# Altium project Project_Controller_Motor_DC.PrjPcb
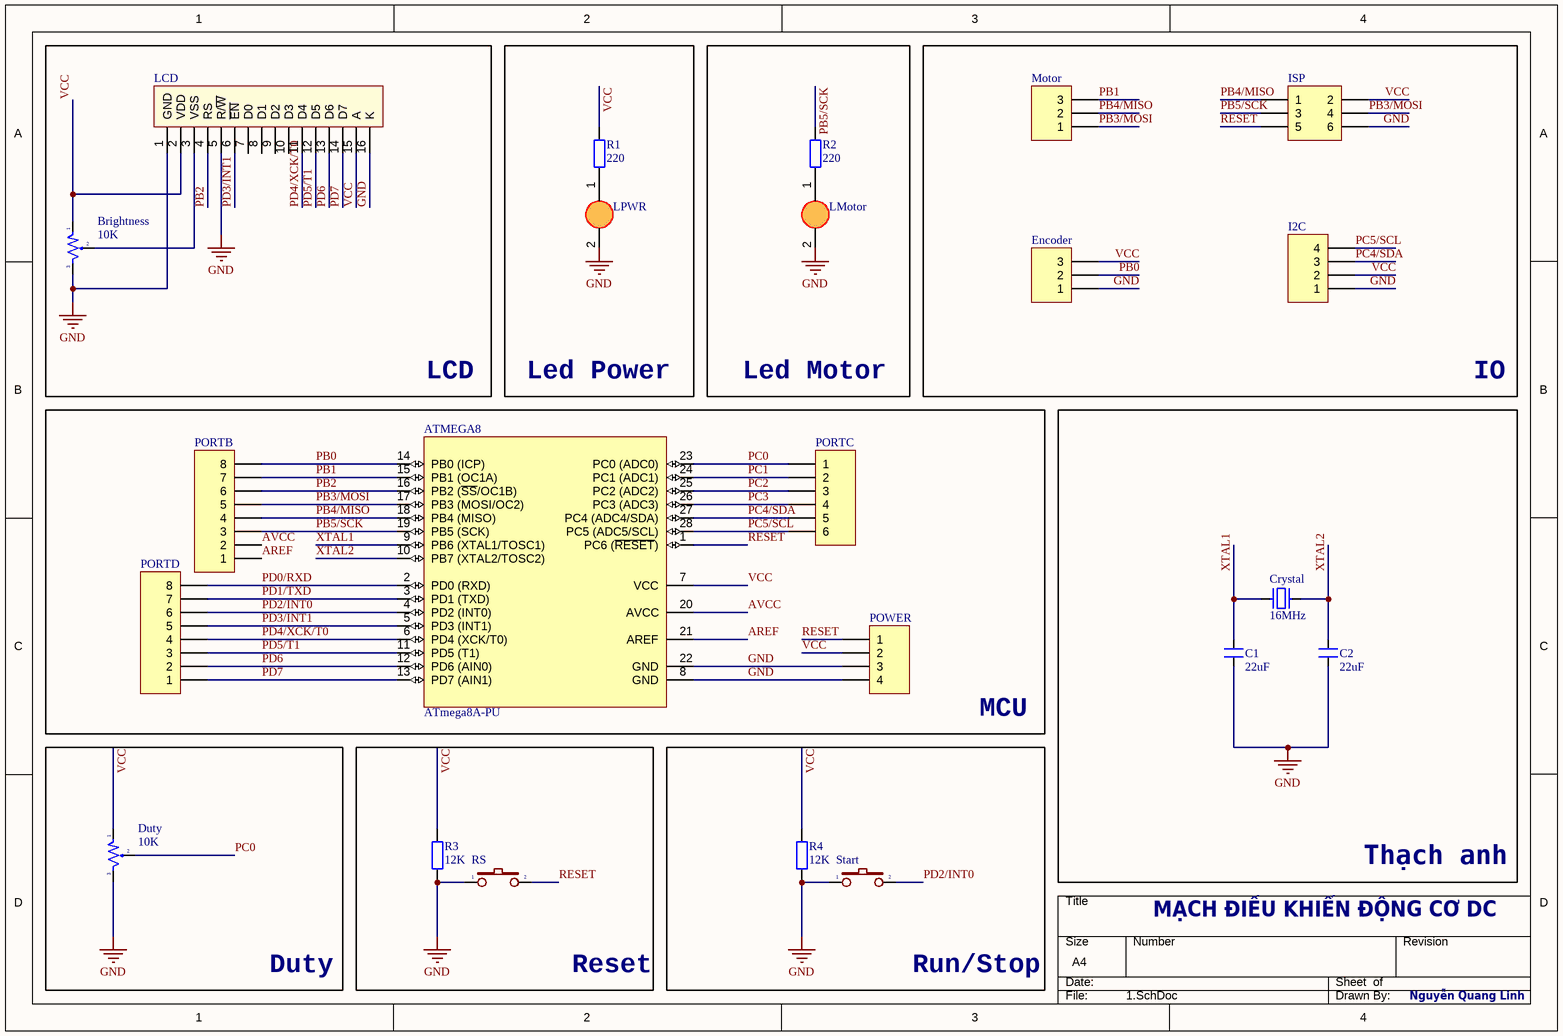
[diagram p0: 1.SchDoc]
1 sheet, 23 parts. Net scope: global (net labels, ports and power ports of the same name join across sheets).
Board file: PCB1.PcbDoc

## Sheet 1.SchDoc
size A4; SheetNumber: 1; SheetTotal: 1

### Parts
ATMEGA8  ATmega8A-PU  [28P3]
Brightness  10K  [VOL-S]
C1  22uF  [CN1.5]
C2  22uF  [CN1.5]
Crystal  16MHz  [XT2]
Duty  10K  [VOL-S]
Encoder  (no value)  [HDR1X3]
I2C  (no value)  [HDR1X4]
ISP  Header 3X2  [HDR2X3]  (value not drawn)
LCD  CD16x2A  [LCD16X2]  (value not drawn)
LMotor  LED5  [LED5MM]  (value not drawn)
LPWR  LED5  [LED5MM]  (value not drawn)
Motor  (no value)  [HDR1X3]
PORTB  Header 8  [HDR1X8]  (value not drawn)
PORTC  (no value)  [HDR1X6]
PORTD  (no value)  [HDR1X8]
POWER  Header 4  [HDR1X4]  (value not drawn)
R1  220  [RES-1/4W-SMALL]
R2  220  [RES-1/4W-SMALL]
R3  12K  [RES-1/4W-SMALL]
R4  12K  [RES-1/4W-SMALL]
RS  SW  [SW2]  (value not drawn)
Start  (no value)  [SW2]

### Blocks framed on the sheet
LCD: Brightness LCD
Led Power: LPWR R1
Led Motor: LMotor R2
IO: Encoder I2C ISP Motor
MCU: ATMEGA8 PORTB PORTC PORTD POWER
Thạch anh: C1 C2 Crystal
Duty: Duty
Reset: R3 RS
Run/Stop: R4 Start

### Nets
GND: ATMEGA8.8(GND) ATMEGA8.22(GND) Brightness.3 C1.1 C2.1 Duty.3 Encoder.1 I2C.1 ISP.6 LCD.1(GND) LCD.5(R/~{W}) LCD.16(K) LMotor.2(K) LPWR.2(K) POWER.3 POWER.4 R3.2 R4.2 RS.1 Start.1
AREF: ATMEGA8.21(AREF) PORTB.1
AVCC: ATMEGA8.20(AVCC) PORTB.2
PB0: ATMEGA8.14(PB0_(ICP)) Encoder.2 PORTB.8
PB1: ATMEGA8.15(PB1_(OC1A)) Motor.3 PORTB.7
PB2: ATMEGA8.16(PB2_(~{SS}/OC1B)) LCD.4(RS) PORTB.6
PB3/MOSI: ATMEGA8.17(PB3_(MOSI/OC2)) ISP.4 Motor.1 PORTB.5
PB4/MISO: ATMEGA8.18(PB4_(MISO)) ISP.1 Motor.2 PORTB.4
PB5/SCK: ATMEGA8.19(PB5_(SCK)) ISP.3 PORTB.3 R2.2
PC0: ATMEGA8.23(PC0_(ADC0)) Duty.2 PORTC.1
PC1: ATMEGA8.24(PC1_(ADC1)) PORTC.2
PC2: ATMEGA8.25(PC2_(ADC2)) PORTC.3
PC3: ATMEGA8.26(PC3_(ADC3)) PORTC.4
PC4/SDA: ATMEGA8.27(PC4_(ADC4/SDA)) I2C.3 PORTC.5
PC5/SCL: ATMEGA8.28(PC5_(ADC5/SCL)) I2C.4 PORTC.6
PD0/RXD: ATMEGA8.2(PD0_(RXD)) PORTD.8
PD1/TXD: ATMEGA8.3(PD1_(TXD)) PORTD.7
PD2/INT0: ATMEGA8.4(PD2_(INT0)) PORTD.6 Start.2
PD3/INT1: ATMEGA8.5(PD3_(INT1)) LCD.6(~{EN}) PORTD.5
PD4/XCK/T0: ATMEGA8.6(PD4_(XCK/T0)) LCD.11(D4) PORTD.4
PD5/T1: ATMEGA8.11(PD5_(T1)) LCD.12(D5) PORTD.3
PD6: ATMEGA8.12(PD6_(AIN0)) LCD.13(D6) PORTD.2
PD7: ATMEGA8.13(PD7_(AIN1)) LCD.14(D7) PORTD.1
RESET: ATMEGA8.1(PC6_(~{RESET})) ISP.5 POWER.1 RS.2
VCC: ATMEGA8.7(VCC) Brightness.1 Duty.1 Encoder.3 I2C.2 ISP.2 LCD.2(VDD) LCD.15(A) POWER.2 R1.2 R3.1 R4.1
XTAL1: ATMEGA8.9(PB6_(XTAL1/TOSC1)) C1.2 Crystal.2
XTAL2: ATMEGA8.10(PB7_(XTAL2/TOSC2)) C2.2 Crystal.1
NetBrightness_2: Brightness.2 LCD.3(VSS)
NetLMotor_1: LMotor.1(A) R2.1
NetLPWR_1: LPWR.1(A) R1.1

Not connected (* = marked no-connect by the designer): LCD 7(D0) 8(D1) 9(D2) 10(D3)

### Notes on the sheet
- MẠCH ĐIỀU KHIỂN ĐỘNG CƠ DC
- Nguyễn Quang Linh
- TITLE
- DESIGNER
- PRODUCT NUMBER
- SHEET VERSION
- LAST MODIFIED
- SHEET
- OF

### Library data of the parts
ATMEGA8 = ATmega8A-PU: 8-bit AVR Microcontroller, 8KB Flash, 512 Bytes EEPROM, 1KB SRAM, 28-pin PDIP, Industrial Grade (-40°C to 85°C); Published: 1-Apr-2010; DatasheetVersion: revC, Jul-2009; PackageVersion: revB, Sep-2001; PackageReference: 28P3; Publisher: Altium Limited; PackageDescription: 28-lead (0.300"/7.62mm Wide) Plastic Dual Inline Package (PDIP); Supplier 1: Digi-Key; Supplier Part Number 1: ATMEGA8A-PU-ND; Supplier 2: Farnell; Supplier Part Number 2: 1748534; Supplier 3: Mouser; Supplier Part Number 3: 556-ATMEGA8A-PU; ComponentLink1Description: Manufacturer Link; ComponentLink1URL: http://www.atmel.com/products/avr/default.asp?; ComponentLink2Description: ATmega8A Datasheet; ComponentLink2URL: http://www.atmel.com/dyn/resources/prod_documents/doc8159.pdf; ComponentLink3Description: ATmega8A Summary; ComponentLink3URL: http://www.atmel.com/dyn/resources/prod_documents/8159S.pdf; ComponentLink4Description: Atmel.com Home; ComponentLink4URL: http://www.atmel.com
Brightness Duty = VOL-S: Var Resistor; Value: Volume 50k
C1 C2 = CN1.5: Cap np 682pF => 104pF; Value: 0.01uF
Crystal = XT2: Crystal For all Crystal 2pin.; Value: 4Mhz
Encoder Motor = Header 3: Header, 3-Pin; LatestRevisionDate: 17-Jul-2002; LatestRevisionNote: Re-released for DXP Platform.; Publisher: Altium Limited
I2C POWER = Header 4: Header, 4-Pin; LatestRevisionDate: 17-Jul-2002; LatestRevisionNote: Re-released for DXP Platform.; Publisher: Altium Limited
ISP = Header 3X2: Header, 3-Pin, Dual row; LatestRevisionDate: 17-Jul-2002; LatestRevisionNote: Re-released for DXP Platform.; Publisher: Altium Limited
LCD = LCD16x2: LCD dipslay 16 char, 2 line; Value: LCD16x2A
LMotor LPWR = LED 5mm
PORTB PORTD = Header 8: Header, 8-Pin; LatestRevisionDate: 17-Jul-2002; LatestRevisionNote: Re-released for DXP Platform.; Publisher: Altium Limited
PORTC = Header 6: Header, 6-Pin; LatestRevisionDate: 17-Jul-2002; LatestRevisionNote: Re-released for DXP Platform.; Publisher: Altium Limited
R1-R4 = RES 1/4W: Resistor 1/4W; Value: R1/4W - 1K
RS Start = SW2: Switch button 2 pin; Value: SW chip 2 pin